# EAGLE design PhatStats Slim Enclosure ESP Lolin32 LITE XTP2046 PCB v1.0 (EAGLE 7.6.0)
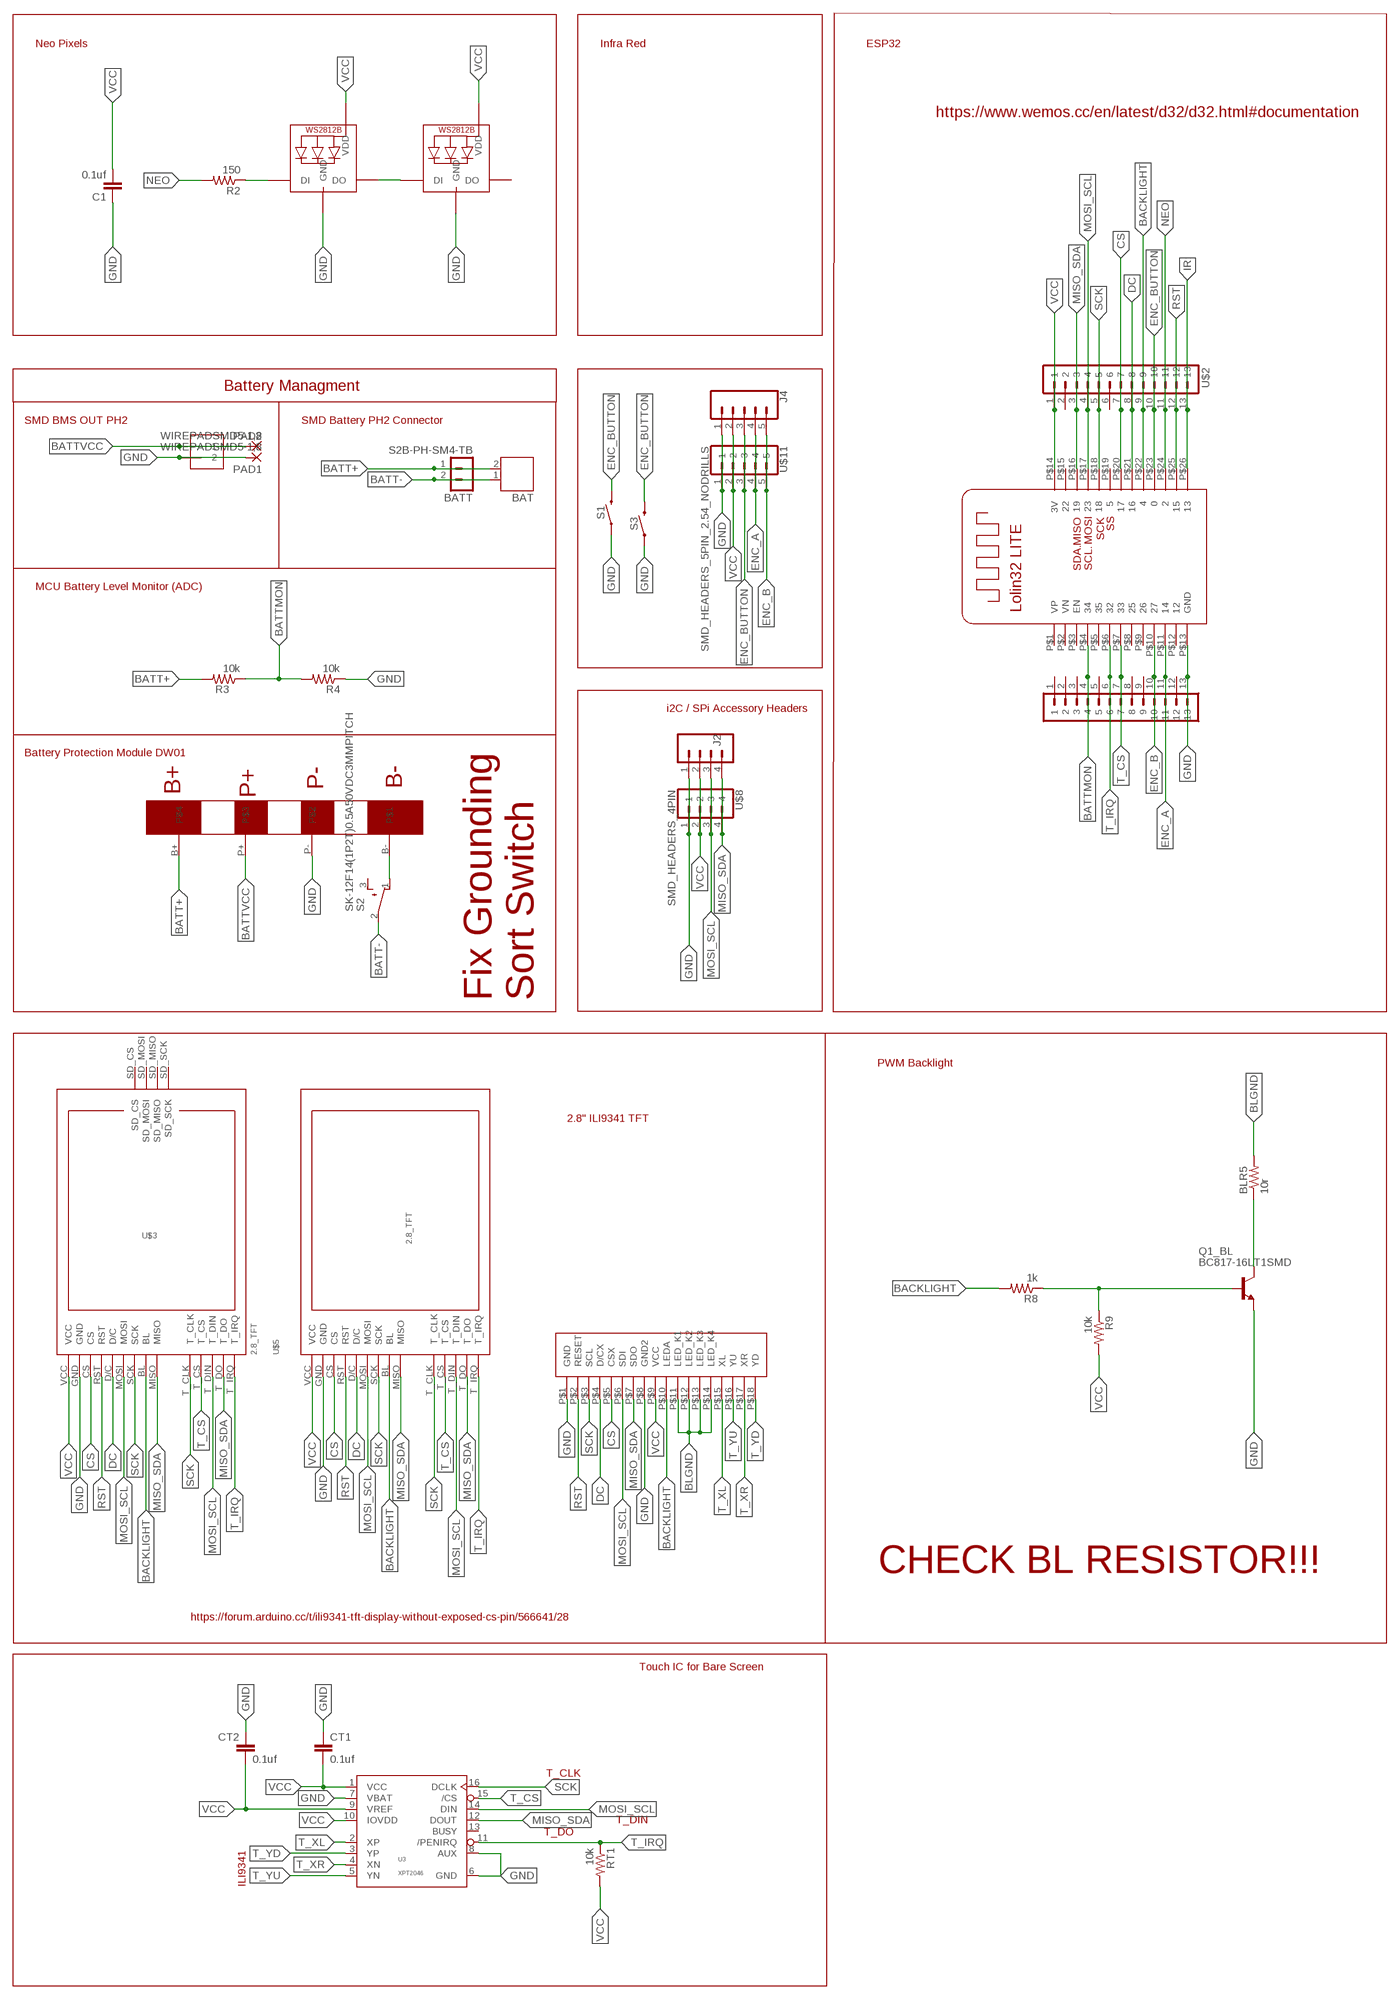
[diagram p0: schematic, sheet 1]

## Parts
0  ILI9341-2.8  [ILI9341-2.8]
BAT  JST-PH2  [JST-PH2]
BATT  S2B-PH-SM4-TB  [S2B-PH-SM4-TB]
BLR5  10r  R-US_M1206  [M1206]
C1  0.1uf  C-EUC1206  [C1206]
CT1  0.1uf  C-EUC1206  [C1206]
CT2  0.1uf  C-EUC1206  [C1206]
DW01-BMS  DW01BATTERYPROT  [DW01BATTERYPROT]
J1  1X2-3.5MM  [1X2-3.5MM]
J2  CONN_04PTH  [1X04]
J4  CONN_05  [1X05]
NEO1  WS2812B5050  [WS2812B]
NEO2  WS2812B5050  [WS2812B]
PAD1  WIREPADSMD5-1,8  [5-1,8]
PAD2  WIREPADSMD5-1,8  [5-1,8]
Q1_BL  BC817-16LT1SMD  [SOT23-BEC]
R2  150  R-US_M1206  [M1206]
R3  10k  R-US_M1206  [M1206]
R4  10k  R-US_M1206  [M1206]
R8  1k  R-US_M1206  [M1206]
R9  10k  R-US_M1206  [M1206]
RT1  10k  R-US_M1206  [M1206]
S1  MOMENTARY-SWITCH-SPST-PTH-6.0MM  [TACTILE_SWITCH_PTH_6.0MM]
S2  SK-12F14(1P2T)0.5A50VDC3MMPITCH  [SK-12F14(1P2T)0.5A50VDC3MMPITCH]
S3  MOMENTARY-SWITCH-SPST-SMD-6.2MM-TALL  [TACTILE_SWITCH_SMD_6.2MM_TALL]
U3  XPT2046  [TSSOP-16]
U$1  SMD_HEADERS_13PIN_2.54_NODRILLS  [SMD_HEADERS_13PIN]
U$2  SMD_HEADERS_13PIN_2.54_NODRILLS  [SMD_HEADERS_13PIN]
U$3  2.8_TFT  [2.8_TFT]
U$5  2.8_TFT  [2.8_TFT]
U$7  TML_LOLIND32_LITE  [TML_LOLIND32_LITE]
U$8  SMD_HEADERS_4PIN  [SMD_HEADERS_4PIN]
U$11  SMD_HEADERS_5PIN_2.54_NODRILLS  [SMD_HEADERS_5PIN]

## Nets
BACKLIGHT: 0.P$10(LEDA) R8.2 U$2.9 U$3.BL U$5.BL U$7.P$22
BATT+: BAT.2 BATT.1 DW01-BMS.B+ R3.2
BATT-: BAT.1 BATT.2 S2.2(P)
BATTMON: R3.1 R4.2 U$1.4 U$7.P$4
BATTVCC: DW01-BMS.P+ J1.1 PAD2.1(P)
BL: BLR5.1 Q1_BL.C
BLGND: 0.P$11(LED_K1) 0.P$12(LED_K2) 0.P$13(LED_K3) 0.P$14(LED_K4) BLR5.2
CS: 0.P$5(CSX) U$2.7 U$3.CS U$5.CS U$7.P$20
DC: 0.P$4(D/CX) U$2.8 U$3.D/C U$5.D/C U$7.P$21
ENC_A: J4.4 U$1.11 U$7.P$11 U$11.4
ENC_B: J4.5 U$1.10 U$7.P$10 U$11.5
ENC_BUTTON: J4.3 S1.3 S3.B2 U$2.10 U$7.P$23 U$11.3
GND: 0.P$1(GND) 0.P$8(GND2) C1.1 CT1.1 CT2.1 DW01-BMS.P- J1.2 J2.1 J4.1 NEO1.3-GND(GND) NEO2.3-GND(GND) PAD1.1(P) Q1_BL.E R4.1 S1.1 S3.A2 U3.6(GND) U3.7(VBAT) U3.8(AUX) U$1.13 U$3.GND U$5.GND U$7.P$13(GND) U$8.1 U$11.1
IR: U$2.13 U$7.P$26
MISO_SDA: 0.P$7(SDO) J2.4 U3.12(DOUT) U$2.3 U$3.MISO U$3.T_DO U$5.MISO U$5.T_DO U$7.P$16 U$8.4
MOSI_SCL: 0.P$6(SDI) J2.3 U3.14(DIN) U$2.4 U$3.MOSI U$3.T_DIN U$5.MOSI U$5.T_DIN U$7.P$17 U$8.3
N$1: DW01-BMS.B- S2.1(O)
N$2: NEO1.2-DOUT(DO) NEO2.4-DIN(DI)
N$4: NEO1.4-DIN(DI) R2.1
N$7: Q1_BL.B R8.1 R9.1
NEO: R2.2 U$2.11 U$7.P$24
RST: 0.P$2(RESET) U$2.12 U$3.RST U$5.RST U$7.P$25
SCK: 0.P$3(SCL) U3.16(DCLK) U$2.5 U$3.SCK U$3.T_CLK U$5.SCK U$5.T_CLK U$7.P$18
T_CS: U3.15(/CS) U$1.7 U$3.T_CS U$5.T_CS U$7.P$7
T_IRQ: RT1.1 U3.11(/PENIRQ) U$1.6 U$3.T_IRQ U$5.T_IRQ U$7.P$6
T_XL: 0.P$15(XL) U3.2(XP)
T_XR: 0.P$17(XR) U3.4(XN)
T_YD: 0.P$18(YD) U3.3(YP)
T_YU: 0.P$16(YU) U3.5(YN)
VCC: 0.P$9(VCC) C1.2 CT1.2 CT2.2 J2.2 J4.2 NEO1.1-VDD(VDD) NEO2.1-VDD(VDD) R9.2 RT1.2 U3.1(VCC) U3.9(VREF) U3.10(IOVDD) U$2.1 U$3.VCC U$5.VCC U$7.P$14(3V) U$8.2 U$11.2
Unconnected: NEO2.2-DOUT(DO) S2.3(S) U3.13(BUSY) U$1.1 U$1.2 U$1.3 U$1.5 U$1.8 U$1.9 U$1.12 U$2.2 U$2.6 U$3.SD_CS U$3.SD_MISO U$3.SD_MOSI U$3.SD_SCK U$7.P$1(VP) U$7.P$2(VN) U$7.P$3(EN) U$7.P$5 U$7.P$8 U$7.P$9 U$7.P$12 U$7.P$15 U$7.P$19

## Notes on the sheet
- Neo Pixels | Infra Red | ESP32
- https://www.wemos.cc/en/latest/d32/d32.html#documentation
- Battery Managment
- SMD BMS OUT PH2 | SMD Battery PH2 Connector
- MCU Battery Level Monitor (ADC)
- i2C / SPi Accessory Headers
- Battery Protection Module DW01
- Fix Grounding
  Sort Switch
- PWM Backlight
- 2.8" ILI9341 TFT
- CHECK BL RESISTOR!!!
- https://forum.arduino.cc/t/ili9341-tft-display-without-exposed-cs-pin/566641/28
- Touch IC for Bare Screen
- T_CLK
- T_DIN
- T_DO
- ILI9341

## Library data of the parts
0 = TML_ili9341_0.8Pitch_Header:ILI9341-2.8
BAT = jst-ph:JST-PH2
BATT = con-JST PH:S2B-PH: JST PH series header 2.00mm pitch disconnectable crimp style connectors, horizontal (side entry type), 2 pins
BLR5 R2-R4 R8 R9 RT1 = resistor:R-US_: RESISTOR, American symbol
C1 CT1 CT2 = rcl:C-EU: CAPACITOR, European symbol
DW01-BMS = TML_DW01_BatteryProtectionModule2:DW01BATTERYPROT
J1 = adafruit:1X2: 3.5mm Terminal block http://www.ladyada.net/library/pcb/eaglelibrary.html
J2 = SparkFun-Connectors:CONN_04: Multi connection point. Often used as Generic Header-pin footprint for 0.1 inch spaced/style header connections On any of the 0.1 inch spaced packages, you can populate with these: Break Away Headers - Straight <https://www.sparkfun.com/products/116> (PRT-00116) Break Away Male Headers - Right Angle <https://www.sparkfun.com/products/553> (PRT-00553) Female Headers <https://www.sparkfun.com/products/115> (PRT-00115) Break Away Headers - Machine Pin <https://www.sparkfun.com/products/117> (PRT-00117) Break Away Female Headers - Swiss Machine Pin <https://www.sparkfun.com/products/743> (PRT-00743) For SCREWTERMINALS and SPRING TERMINALS visit here: Screw Terimnals on SparkFun.com <https://www.sparkfun.com/search/results?term=Screw+Terminals> (5mm/3.5mm/2.54mm spacing) This device is also useful as a general connection point to wire up your design to another part of your project. Our various solder wires solder well into these plated through hole pads. Hook-Up Wire - Assortment (Stranded, 22 AWG) <https://www.sparkfun.com/products/11375> (PRT-11375) Hook-Up Wire - Assortment (Solid Core, 22 AWG) <https://www.sparkfun.com/products/11367> (PRT-11367) View the entire wire category on our website here <https://www.sparkfun.com/categories/141> Special notes: Molex polarized connector foot print use with SKU : PRT-08231 with associated crimp pins and housings. 1MM SMD Version SKU: PRT-10208; PROD_ID: CONN-09696
J4 = SparkFun-Connectors:CONN_05: Multi connection point. Often used as Generic Header-pin footprint for 0.1 inch spaced/style header connections On any of the 0.1 inch spaced packages, you can populate with these: Break Away Headers - Straight <https://www.sparkfun.com/products/116> (PRT-00116) Break Away Male Headers - Right Angle <https://www.sparkfun.com/products/553> (PRT-00553) Female Headers <https://www.sparkfun.com/products/115> (PRT-00115) Break Away Headers - Machine Pin <https://www.sparkfun.com/products/117> (PRT-00117) Break Away Female Headers - Swiss Machine Pin <https://www.sparkfun.com/products/743> (PRT-00743) For SCREWTERMINALS and SPRING TERMINALS visit here: Screw Terimnals on SparkFun.com <https://www.sparkfun.com/search/results?term=Screw+Terminals> (5mm/3.5mm/2.54mm spacing) This device is also useful as a general connection point to wire up your design to another part of your project. Our various solder wires solder well into these plated through hole pads. Hook-Up Wire - Assortment (Stranded, 22 AWG) <https://www.sparkfun.com/products/11375> (PRT-11375) Hook-Up Wire - Assortment (Solid Core, 22 AWG) <https://www.sparkfun.com/products/11367> (PRT-11367) View the entire wire category on our website here <https://www.sparkfun.com/categories/141> Special notes: Molex polarized connector foot print use with SKU : PRT-08231 with associated crimp pins and housings. 1MM SMD Version SKU: PRT-10208
NEO1 NEO2 = adafruit:WS2812B
PAD1 PAD2 = wirepad:WIREPAD: Wire PAD connect wire on PCB
Q1_BL = transistor-npn:BC817*: NPN Transistor
S1 = SparkFun-Switches:MOMENTARY-SWITCH-SPST: Momentary Switch (Pushbutton) - SPST Normally-open (NO) SPST momentary switches (buttons, pushbuttons). Variants PTH-12MM - 12mm square, through-hole Momentary Pushbutton Switch - 12mm Square <https://www.sparkfun.com/products/9190> (COM-09190) PTH-6.0MM, PTH-6.0MM-KIT - 6.0mm square, through-hole Mini Pushbutton Switch <https://www.sparkfun.com/products/97> (COM-00097) KIT package intended for soldering kit's - only one side of pads' copper is exposed. PTH-RIGHT-ANGLE-KIT - Right-angle, through-hole Right Angle Tactile Button <https://www.sparkfun.com/products/10791> - Used on SparkFun BigTime Watch Kit <https://www.sparkfun.com/products/11734> SMD-12MM - 12mm square, surface-mount Tactile Button - SMD (12mm) <https://www.sparkfun.com/products/12993> (COM-12993) Used on SparkFun PicoBoard <https://www.sparkfun.com/products/11888> SMD-4.5MM - 4.5mm Square Trackball Switch Used on SparkFun Blackberry Trackballer Breakout <https://www.sparkfun.com/products/13169> SMD-4.6MMX2.8MM - 4.60mm x 2.80mm, surface mount Used on SparkFun SAMD21 Mini Breakout <https://www.sparkfun.com/products/13664> SMD-5.2MM, SMD-5.2-REDUNDANT - 5.2mm square, surface-mount Mini Pushbutton Switch - SMD <https://www.sparkfun.com/products/8720> (COM-08720) Used on Arduino Pro Mini <https://www.sparkfun.com/products/11114> REDUNDANT package connects both switch circuits together SMD-6.0X3.5MM - 6.0 x 3.5mm, surface mount Momentary Reset Switch SMD <https://www.sparkfun.com/products/8229> (COM-08229) SMD-6.2MM-TALL - 6.2mm square, surface mount Tactile Button - SMD (6mm) <https://www.sparkfun.com/products/12992> Used on SparkFun Digital Sandbox <https://www.sparkfun.com/products/12651> SMD-RIGHT-ANGLE - Right-angle, surface mount Used on SparkFun Block for Intel® Edison - Arduino <https://www.sparkfun.com/products/13036>; PROD_ID: SWCH-08441; SF_SKU: COM-00097
S2 = TML_SK-12F14(1P2T)  90D 0.5a 50vdc 3mm pitch:SK-12F14(1P2T)0.5A50VDC3MMPITCH: SK-12F14(1P2T) 0.5a 50vdc 3mm pitch
S3 = SparkFun-Switches:MOMENTARY-SWITCH-SPST: Momentary Switch (Pushbutton) - SPST Normally-open (NO) SPST momentary switches (buttons, pushbuttons). Variants PTH-12MM - 12mm square, through-hole Momentary Pushbutton Switch - 12mm Square <https://www.sparkfun.com/products/9190> (COM-09190) PTH-6.0MM, PTH-6.0MM-KIT - 6.0mm square, through-hole Mini Pushbutton Switch <https://www.sparkfun.com/products/97> (COM-00097) KIT package intended for soldering kit's - only one side of pads' copper is exposed. PTH-RIGHT-ANGLE-KIT - Right-angle, through-hole Right Angle Tactile Button <https://www.sparkfun.com/products/10791> - Used on SparkFun BigTime Watch Kit <https://www.sparkfun.com/products/11734> SMD-12MM - 12mm square, surface-mount Tactile Button - SMD (12mm) <https://www.sparkfun.com/products/12993> (COM-12993) Used on SparkFun PicoBoard <https://www.sparkfun.com/products/11888> SMD-4.5MM - 4.5mm Square Trackball Switch Used on SparkFun Blackberry Trackballer Breakout <https://www.sparkfun.com/products/13169> SMD-4.6MMX2.8MM - 4.60mm x 2.80mm, surface mount Used on SparkFun SAMD21 Mini Breakout <https://www.sparkfun.com/products/13664> SMD-5.2MM, SMD-5.2-REDUNDANT - 5.2mm square, surface-mount Mini Pushbutton Switch - SMD <https://www.sparkfun.com/products/8720> (COM-08720) Used on Arduino Pro Mini <https://www.sparkfun.com/products/11114> REDUNDANT package connects both switch circuits together SMD-6.0X3.5MM - 6.0 x 3.5mm, surface mount Momentary Reset Switch SMD <https://www.sparkfun.com/products/8229> (COM-08229) SMD-6.2MM-TALL - 6.2mm square, surface mount Tactile Button - SMD (6mm) <https://www.sparkfun.com/products/12992> Used on SparkFun Digital Sandbox <https://www.sparkfun.com/products/12651> SMD-RIGHT-ANGLE - Right-angle, surface mount Used on SparkFun Block for Intel® Edison - Arduino <https://www.sparkfun.com/products/13036>; PROD_ID: SWCH-11966; SF_SKU: COM-12992
U3 = TML_XPT2046:XPT2046: XPT2046 touch screen controller General Description The XPT2046 is a 4-wire resistive touch screen controller that incorporates a 12-bit 125 kHz sampling SAR type A/D converter. The XPT2046 operates down to 2.2V supply voltage and supports digital I/O interface voltage from 1.5V to VCC in order to connect low voltage uP. The XPT2046 can detect the pressed screen location by performing two A/D conversions. In addition to location, the XPT2046 also measures touch screen pressure.On-chip VREF can be utilized for analog auxiliary input, temperature measurement and battery monitoring withthe ability to measure voltage from 0V to 5V. The XPT2046 also has an on-chip temperature sensor The XPT2046 is available in 16pin QFN thin package(0.75mm in height) and has the operating temperature range of -40°C to +85°C Features 12 bit SAR type A/D converter with S/H circuit Low voltage operation (VCC = 2.2V ∼ 3.6V) Low voltage digital I/F (1.5V ∼ VCC) 4-wire I/F Sampling frequency: 125 kHz (max) On-Chip voltage reference (2.5V) Pen pressure measurement On-chip thermo sensor Direct battery masurement Low power consumption (260μA) Package 16pin QFN Check prices <https://pricing.snapeda.com/parts/XPT2046/Xptek/view-part?ref=eda>; AVAILABILITY: Not in stock; DESCRIPTION: RASPBERRY PI 3.5 TFT DISPLAY; MF: Xptek; MP: XPT2046; PACKAGE: Package; PRICE: None
U$1 U$2 = TML_SMD_Headers_2.54_NoDrill:SMD_HEADERS_13PIN_2.54_NODRILLS
U$3 = TML_ili9341-2.8_tft-display_Corrected:2.8_TFT: ILI9341 2.8" 2.8 inch TFT SPI Touch Panel 240X320 http://www.lcdwiki.com/2.8inch_SPI_Module_ILI9341_SKU:MSP2807 http://www.lcdwiki.com/Run_Arduino_Demo_in_spi_model
U$5 = TML_ili9341-2.8_tft-display_PinHeader only:2.8_TFT: ILI9341 2.8" 2.8 inch TFT SPI Touch Panel 240X320 http://www.lcdwiki.com/2.8inch_SPI_Module_ILI9341_SKU:MSP2807 http://www.lcdwiki.com/Run_Arduino_Demo_in_spi_model
U$7 = TML_Wemos LOLIN32 LITE ESP32 Round Pads:TML_LOLIND32_LITE: Wemos Lolin32 LITE Lolin32 LITE is a development board based on ESP32. On this schematic, this board is designed with battery port. Pins VP and VN are Not Connected pins.
U$8 = TML_SMD_Headers_2.54_NoDrill:SMD_HEADERS_4PIN
U$11 = TML_SMD_Headers_2.54_NoDrill:SMD_HEADERS_5PIN_2.54_NODRILLS

## Board
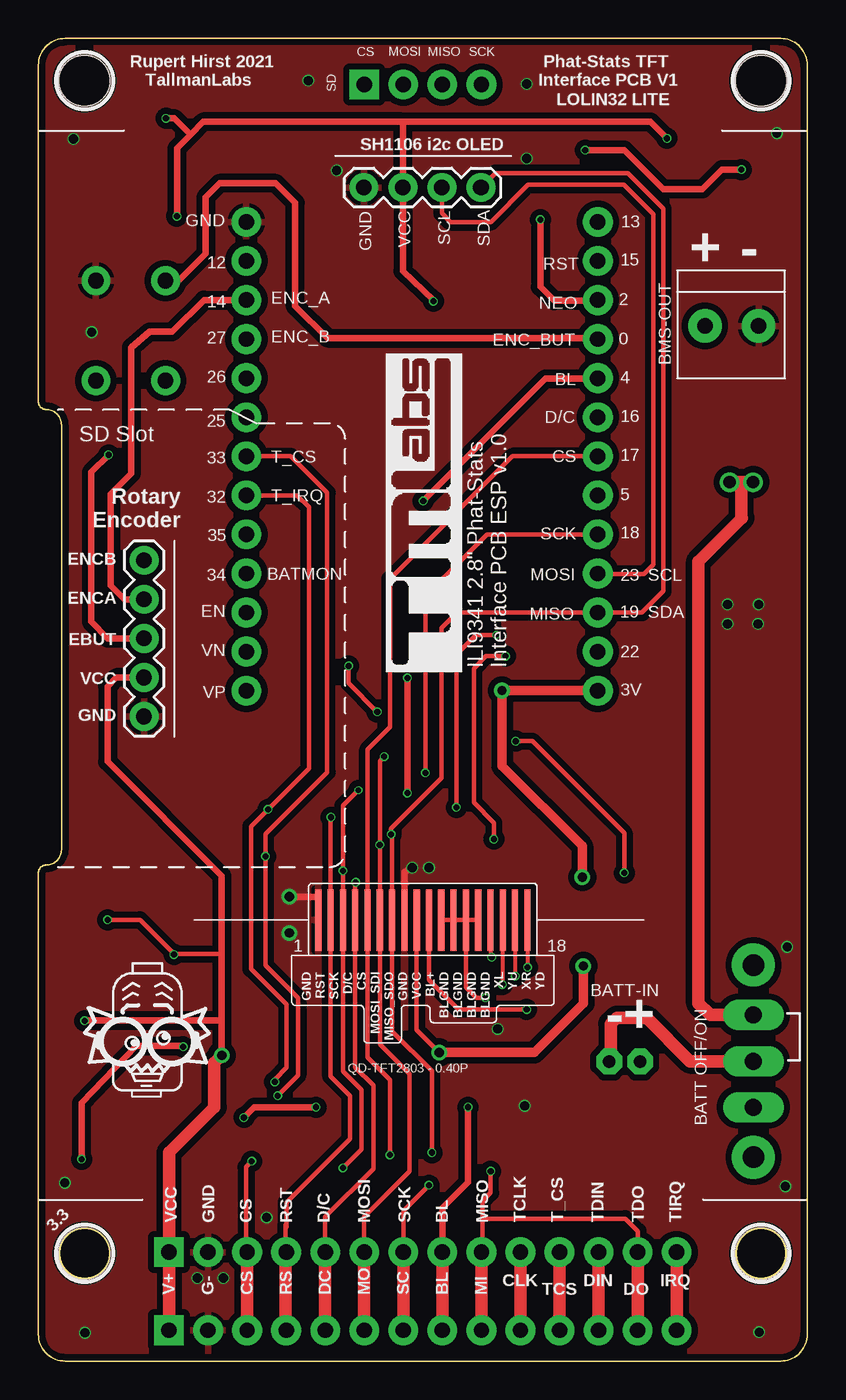
[diagram p1: board, top side]
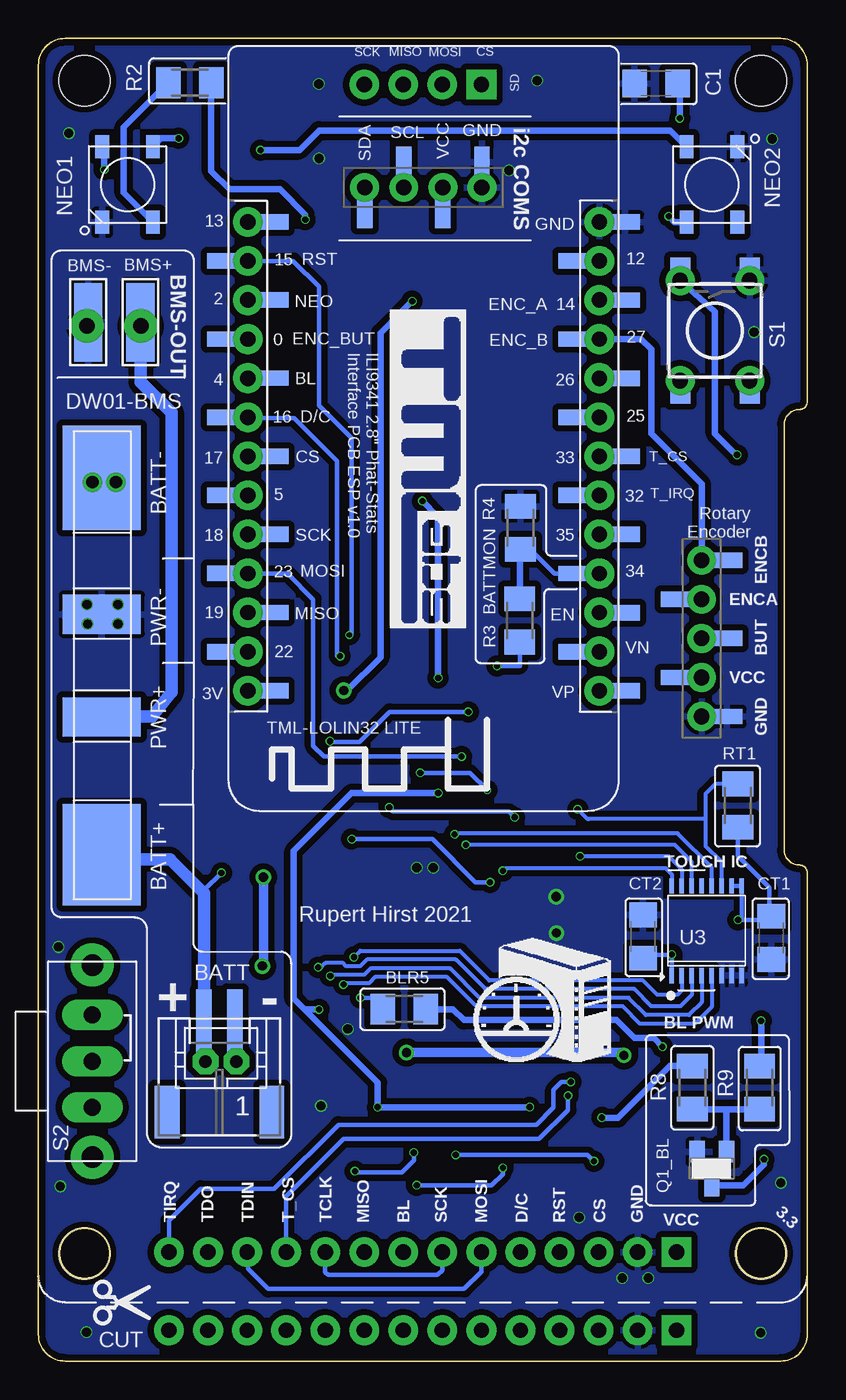
[diagram p2: board, bottom side, seen from below]

Size 50 x 86 mm. Coordinates in mm from the lower left corner, seen from the top.
Outline: 50,84.27 50,1.73 arc-90 48.27,0 1.73,0 arc-90 0,1.73 0,31.75 arc-90 0.5,32.25 arc90 1.5,33.25 1.5,60.88 arc90 0.5,61.88 arc-90 0,62.38 0,84.27 arc-90 1.73,86 48.27,86 arc-90 50,84.27
Outline: circle at 47,7 radius 1.6
Outline: circle at 3,7 radius 1.6
Copper layers (1*16): Top 0.035mm / dielectric 1.6mm / Bottom 0.035mm
Design rules "jlcpcb-2layers": minimum track width 5mil, minimum drill 0.3mm, track to track 5mil, track to pad 5mil, pad to pad 5mil, via to via 5mil, smd to smd 5mil, copper to edge 0.2mm, drill to drill 6mil, minimum pad ring 10mil, minimum via ring 3mil, stop-mask expansion 4mil, vias tented up to drill 0mil, thermal gap 10mil
Holes 3.3 mm at 3,83.25 47,83.25 47,7 3,7

### Footprints (pad centres in the part's own frame; a part is rotated, then mirrored left to right if it is on the bottom)
ILI9341-2.8 = smd 4 x 0.4: P$1 -18,6.8; P$2 -18,6; P$3 -18,5.2; P$4 -18,4.4; P$5 -18,3.6; P$6 -18,2.8; P$7 -18,2; P$8 -18,1.2; P$9 -18,0.4; P$10 -18,-0.4; P$11 -18,-1.2; P$12 -18,-2; P$13 -18,-2.8; P$14 -18,-3.6; P$15 -18,-4.4; P$16 -18,-5.2; P$17 -18,-6; P$18 -18,-6.8
JST-PH2 = drill 0.813 pad 1.676 octagon: 1 1,0; 2 -1,0
S2B-PH-SM4-TB = smd 1 x 4.5: 1 1,0; 2 -1,0 | smd 1.6 x 3.4: M1 3.4,5.75; M2 -3.4,5.75
M1206 = smd 1.6 x 2: 1 -1.4,0; 2 1.4,0
C1206 = smd 1.6 x 1.8: 1 -1.4,0; 2 1.4,0
DW01BATTERYPROT = smd 5.08 x 2.54: B+ 3.175,29.15; B+1 3.175,26.745; B+2 3.175,6.405; B+3 3.175,30.805; B- 3.175,4.31; B-1 3.175,2.155; P+ 3.175,19.839; P- 3.175,13.154
1X2-3.5MM = drill 1 pad 2.184: 1 1.8,0; 2 -1.7,0
1X04 = drill 1.016 pad 1.88: 1 0,0; 2 2.54,0; 3 5.08,0; 4 7.62,0
1X05 = drill 1.016 pad 1.88: 1 0,0; 2 2.54,0; 3 5.08,0; 4 7.62,0; 5 10.16,0
WS2812B = smd 1.5 x 0.9: 1-VDD 2.45,-1.65; 2-DOUT 2.45,1.65; 3-GND -2.45,1.65; 4-DIN -2.45,-1.65
5-1,8 = smd 1.829 x 5.08: 1 0,0
SOT23-BEC = smd 1 x 1.4: B -0.95,-1.1; C 0,1.1; E 0.95,-1.1
TACTILE_SWITCH_PTH_6.0MM = drill 1.016 pad 1.88: 1 -3.251,2.261; 2 3.251,2.261; 3 -3.251,-2.261; 4 3.251,-2.261
SK-12F14(1P2T)0.5A50VDC3MMPITCH = drill 1.1 pad 1.422 long: 1 -3,0; 2 0,0; 3 3,0 | drill 1.4 pad 2.8: M1 -6.25,0; M2 6.25,0
TACTILE_SWITCH_SMD_6.2MM_TALL = smd 1.55 x 1.3: A1 -3.975,-2.25; A2 3.975,-2.25; B1 -3.975,2.25; B2 3.975,2.25
TSSOP-16 = smd 0.305 x 0.991: 1 -2.275,-2.918; 2 -1.625,-2.918; 3 -0.975,-2.918; 4 -0.325,-2.918; 5 0.325,-2.918; 6 0.975,-2.918; 7 1.625,-2.918; 8 2.275,-2.918; 9 2.275,2.918; 10 1.625,2.918; 11 0.975,2.918; 12 0.325,2.918; 13 -0.325,2.918; 14 -0.975,2.918; 15 -1.625,2.918; 16 -2.275,2.918
SMD_HEADERS_13PIN = smd 1 x 2: 1 1.27,-0.38; 2 3.81,2.92; 3 6.35,-0.38; 4 8.89,2.92; 5 11.43,-0.38; 6 13.97,2.92; 7 16.51,-0.38; 8 19.05,2.92; 9 21.59,-0.38; 10 24.13,2.92; 11 26.67,-0.38; 12 29.21,2.92; 13 31.75,-0.38
2.8_TFT = drill 1 pad 1.93: BL 26.27,2; CS 13.57,2; D/C 18.65,2; GND 11.03,2; MISO 28.81,2; MOSI 21.19,2; RST 16.11,2; SCK 23.73,2; SD_MISO 26.27,83; SD_MOSI 23.73,83; SD_SCK 28.81,83; T_CLK 31.35,2; T_CS 33.89,2; T_DIN 36.43,2; T_DO 38.97,2; T_IRQ 41.51,2 | drill 1 pad 1.93 square: SD_CS 21.19,83; VCC 8.49,2
2.8_TFT' = drill 1 pad 1.93: BL 26.27,2; CS 13.57,2; D/C 18.65,2; GND 11.03,2; MISO 28.81,2; MOSI 21.19,2; RST 16.11,2; SCK 23.73,2; T_CLK 31.35,2; T_CS 33.89,2; T_DIN 36.43,2; T_DO 38.97,2; T_IRQ 41.51,2 | drill 1 pad 1.93 square: VCC 8.49,2
TML_LOLIND32_LITE = drill 1 pad 1.93: P$1 -11.48,17.91; P$2 -11.48,15.37; P$3 -11.48,12.83; P$4 -11.48,10.29; P$5 -11.48,7.75; P$6 -11.48,5.21; P$7 -11.48,2.67; P$8 -11.48,0.13; P$9 -11.48,-2.41; P$10 -11.48,-4.95; P$11 -11.48,-7.49; P$12 -11.48,-10.03; P$13 -11.48,-12.57; P$14 11.38,17.91; P$15 11.38,15.37; P$16 11.38,12.83; P$17 11.38,10.29; P$18 11.38,7.75; P$19 11.38,5.21; P$20 11.38,2.67; P$21 11.38,0.13; P$22 11.38,-2.41; P$23 11.38,-4.95; P$24 11.38,-7.49; P$25 11.38,-10.03; P$26 11.38,-12.57
SMD_HEADERS_4PIN = smd 1 x 2: 1 1.27,-0.38; 2 3.81,2.92; 3 6.35,-0.38; 4 8.89,2.92
SMD_HEADERS_5PIN = smd 1 x 2: 1 1.27,-0.38; 2 3.81,2.92; 3 6.35,-0.38; 4 8.89,2.92; 5 11.43,-0.38

### Placement (x,y rotation side)
0  25,46.68 90 top
BAT  38.13,19.48 0 bottom
BATT  38.23,21.93 180 bottom
BLR5  26.2,22.89 180 bottom
C1  9.84,83.07 0 bottom
CT1  2.33,27.52 90 bottom
CT2  10.68,27.61 270 bottom
DW01-BMS  42.7,61.71 180 bottom
J1  45.15,67.31 180 top
J2  21.16,76.31 0 top
J4  6.87,41.91 90 top
NEO1  44.2,76.5 90 bottom
NEO2  6.2,76.5 270 bottom
PAD1  46.76,67.54 0 bottom
PAD2  43.37,67.54 0 bottom
Q1_BL  6.21,12.51 180 bottom
R2  40.16,83.12 0 bottom
R3  18.7,48.16 270 bottom
R4  18.66,54.17 270 bottom
R8  7.47,17.78 90 bottom
R9  3.1,17.78 90 bottom
RT1  4.52,36.12 270 bottom
S1  6,67 270 bottom
S2  46.5,19.5 270 bottom
S3  6,67 90 bottom
U3  6.54,27.98 0 bottom
U$1  12.25,42.32 90 bottom
U$2  35.11,42.32 90 bottom
U$3  0,0 0 top
U$4  [HSMSMALL]  21.49,18.52 0 bottom
U$5  2.8_TFT  [2.8_TFT']  0,5.08 0 top
U$6  [MADPROF]  4.8,16.93 0 top
U$7  25,61.5 180 bottom
U$8  19.89,77.57 180 bottom
U$9  [TMSLOGO_INVERTED]  28.47,69.01 270 bottom
U$10  [TMSLOGO_INVERTED]  28.89,44.16 90 top
U$11  5.6,40.64 90 bottom
U$13  [SCISSORS_TS]  46.99,5.08 0 bottom

### Tracks (layer width: path | path; a pad name or v marks a point on that pad's centre or on a via)
BACKLIGHT  (via drill 0.4)
  Top 0.305: 0.P$10 25.4,24.8 27.33,22.86 v31.75,22.86 | 36.23,63.88 U$7.P$22
  Top 0.406: v24,44.42 v24,36.94 | v25.02,55.92 32.98,63.88 36.23,63.88 | v18.05,16.51 14.04,16.51 v13.36,15.84 | U$5.BL 26.27,9.96 27.94,11.63 v27.94,16.51
  Top 0.813: U$3.BL U$5.BL
  Bottom 0.305: v25.02,55.92 25.02,55.91
  Bottom 0.406: v24,44.42 24,54.88 25.02,55.91 | R8.2 8.95,19.18 12.31,15.81 13.34,15.81 v13.36,15.84 | U$7.P$22 U$2.9 | U$2.9 | v18.05,16.51 v27.94,16.51 27.94,18.11 32.69,22.86 | v24,36.94 29.62,36.94 33.4,33.17 33.4,23.57 32.69,22.86 | 32.69,22.86 v31.75,22.86
BATT+  (via drill 0.4)
  Top 0.305: v22.04,42.21 20.18,44.08 v20.18,45.2 | v31.04,40.31 32.12,40.31 38.1,34.33 v38.1,31.75
  Bottom 0.152: 45.81,32.62 DW01-BMS.B+
  Bottom 0.305: v22.04,42.21 27.16,42.21 29.11,40.27 31,40.27 v31.04,40.31 | v20.18,45.2 18.7,45.2 R3.2 | v38.1,31.75 39.23,30.62 39.23,30.42
  Bottom 0.406: 18.38,46.7 R3.2 | BATT.1 39.13,21.93 BAT.2
  Bottom 0.813: BATT.1 39.23,30.42 41.44,32.62 45.81,32.62
BATT-
  Top 0.813: S2.2 42.38,19.5 39.56,22.31 39.37,22.31 37.61,22.31 BATT.2 37.23,19.58 BAT.1
  Bottom 0.406: BATT.2 37.13,21.93
  Bottom 0.813: BATT.2 37.31,21.93 37.31,21.94 | 37.13,21.93 BAT.1
BATTMON
  Bottom 0.305: 18.57,52.69 R4.2 | 18.7,52.73 17.97,52.73 16.44,51.2 15.24,51.2 | 15.24,51.2 14.38,51.2 14.37,51.21 | U$7.P$4 15.23,51.21 15.24,51.2
  Bottom 0.406: R3.1 18.7,52.73 R4.2 | U$7.P$4 14.37,51.21 U$1.4
BATTVCC
  Bottom 0.406: J1.1 43.37,67.31 PAD2.1
  Bottom 0.813: J1.1 43.34,63.66 41.35,61.67 41.35,43.52 42.62,41.91 45.46,41.91 DW01-BMS.P+
BL  (via drill 0.4)
  Top 0.406: v2.81,13.12 2.81,16.78 6.35,20.51 9.35,20.51 v9.42,20.44
  Bottom 0.406: Q1_BL.C 4.15,11.41 2.81,12.75 v2.81,13.12 | v9.42,20.44 9.98,21 11.26,21 12.43,22.17 22.33,22.17 23.04,22.88 24.8,22.88 BLR5.1
BLGND  (via drill 0.4)
  Top 0.305: 0.P$14 0.P$13 | 0.P$13 0.P$12 0.P$11 | 0.P$13 27.8,24.3 28.48,23.62 v29.06,23.62
  Top 0.406: 0.P$13 27.77,28.68
  Bottom 0.305: v29.06,23.62 28.12,23.62 27.61,23.11 BLR5.2
  Bottom 0.406: BLR5.2 27.61,22.95 27.9,23.25
CS  (via drill 0.4)
  Top 0.305: U$7.P$20 30.84,58.83 22.86,50.85 22.86,41.22 21.41,39.76 21.41,35.38 0.P$5 21.4,19.76 22.86,18.3 v22.86,13.41 | U$5.CS 13.49,7.16 13.49,12.62 v13.87,12.99
  Top 0.813: U$3.CS U$5.CS
  Bottom 0.305: v22.86,13.41 14.29,13.41 v13.87,12.99
  Bottom 0.406: U$7.P$20 U$2.7 | U$2.7
DC  (via drill 0.4)
  Top 0.305: U$5.D/C 18.65,9.38 21.78,12.51 21.78,17.93 20.6,19.1 0.P$4 20.6,31.1 v20.62,31.12 | v29.62,33.94 29.62,35 28.31,36.31 28.31,45.04 29.11,45.84 v30.38,45.84
  Top 0.813: U$3.D/C U$5.D/C
  Bottom 0.305: v30.38,45.84 30.57,45.84 30.57,58.51 33.38,61.31 36.32,61.31 U$7.P$21 | v20.62,31.12 21.56,31.12 24.38,33.94 v29.62,33.94
  Bottom 0.406: U$7.P$21 U$2.8 | U$2.8
ENC_A
  Top 0.406: J4.4 5.6,49.53 4.71,50.42 4.71,56.38 6.04,57.71 6.04,65.91 7.25,66.94 8.7,66.94 10.76,69 13.37,69 U$7.P$11
  Bottom 0.406: U$1.11 U$7.P$11 | U$11.4 J4.4
ENC_B
  Bottom 0.406: U$1.10 U$7.P$10 10.81,66.45 10.15,65.78 10.15,60.3 6.87,57.02 J4.5 U$11.5
ENC_BUTTON  (via drill 0.4)
  Top 0.406: J4.3 4.52,46.99 3.44,48.07 3.44,57.8 v4.56,58.92 | S1.3 8.12,70.35 9.22,70.35 10.88,72 10.88,75.67 11.78,76.58 15.43,76.58 16.7,75.31 16.7,68.58 18.79,66.53 36.12,66.52 U$7.P$23
  Bottom 0.406: v4.56,58.92 4.61,58.92 6,60.31 6,68.23 S1.3 | 8.06,70.29 S1.3 | S1.3 8.09,71 S3.B2 | U$7.P$23 U$2.10 | U$2.10 | U$11.3 J4.3
GND  (via drill 0.6, 0.6 pad 1)
  Top 0.406: 0.P$1 18.21,30.18 v16.32,30.19 | 0.P$8 23.8,31.79 v24.32,32.08
  Bottom 0.305: v44.83,47.93 44.83,48.53 | v46.84,49.2 46.52,49.2 DW01-BMS.P- 46.17,48.56 v46.8,47.93
  Bottom 0.406: U$7.P$13 U$1.13
  Bottom 0.813: 46.99,66.75 PAD1.1 | v44.83,49.2 44.83,48.53 DW01-BMS.P-
  other vias: 46.88,1.88 1.71,11.59 3.02,1.84 12.03,5.4 3.46,66.9 48.02,79.84 2.27,79.47 14.84,9.34 10.34,5.4 31.76,83.05 29.88,21.59 48.58,11.36 31.62,16.59 17.56,83.26 19.39,77.42 31.75,78.2 25.4,32.08 48.7,26.93 16.31,27.84
  pour Bottom (isolate 0.406): -1.27,-1.27 -1.27,87.63 50.8,87.63 50.8,-1.27
  pour Top (isolate 0.406): 52.07,-2.54 52.07,88.9 -2.54,88.9 -2.54,-2.54
IR
  Bottom 0.254: U$7.P$26 U$2.13 | U$2.13
MISO_SDA  (via drill 0.4)
  Top 0.305: v25.59,13.55 25.59,18.86 23,21.45 0.P$7 23,34.25 v22.93,34.25 22.93,34.63 26.21,37.9 26.21,47.65 27.23,48.67 U$7.P$16 39.25,48.67 40.64,50.06 40.64,74.93 38.32,77.25 29.72,77.25 J2.4 | U$5.MISO 28.81,7.62 28.88,7.68 28.88,9.27 | v29.41,12.34 29.41,10.93 28.88,10.39 28.88,9.27 | 28.88,9.27 38.17,9.27 39,8.44 39,7.11 U$5.T_DO
  Top 0.813: U$3.MISO U$5.MISO | U$3.T_DO U$5.T_DO
  Bottom 0.254: U3.12 6.21,32.09 8.44,34.31 22.93,34.31 v22.93,34.25
  Bottom 0.305: v29.41,12.34 29.34,12.27 26.36,12.27 25.59,13.04 v25.59,13.55 | U$7.P$16 35.48,48.67
  Bottom 0.406: U$7.P$16 35.56,48.67 | U$2.3 35.48,48.67 | 35.48,48.67 | U$8.4 J2.4
MOSI_SCL  (via drill 0.4)
  Top 0.305: v22.48,39.31 22.2,39.03 v22.2,33.56 22.2,33.42 0.P$6 22.2,20.61 24.13,18.68 24.13,12.32 21.19,9.38 U$5.MOSI | J2.3 26.24,74.64 26.81,74.06 29.44,74.06 31.85,76.48 38.09,76.48 39.98,74.58 39.98,51.8 39.38,51.19 36.4,51.19 U$7.P$17
  Top 0.813: U$5.MOSI U$3.MOSI | U$5.T_DIN U$3.T_DIN
  Bottom 0.254: U3.14 7.51,32.45 8.62,33.56 v22.2,33.56
  Bottom 0.305: U$7.P$17 33.8,51.21 32.12,49.53 32.12,40 31.43,39.31 v22.48,39.31 | U$5.MOSI 21.19,5.81 22.31,4.69 35.06,4.69 36.38,6 36.38,7.03 U$5.T_DIN
  Bottom 0.406: U$7.P$17 U$2.4 | U$2.4 | U$8.3 J2.3
N$1  (via drill 0.8 pad 1.27)
  Top 0.813: S2.1 43.69,22.5 42.92,23.26 42.92,51.99 45.75,54.82 45.72,54.82 45.72,57.15 | v46.48,57.15 45.72,57.15 | 45.72,57.15 v44.96,57.15
  Bottom 0.813: DW01-BMS.B- 45.72,57.4 45.72,57.15 v46.48,57.15
N$2  (via drill 0.4)
  Top 0.406: v45.72,77.47 44.45,77.47 43.18,76.2 40.64,76.2 38.1,78.74 v35.56,78.74
  Bottom 0.406: NEO1.2-DOUT 45.72,78.97 v45.72,77.47 | NEO2.4-DIN 8.91,80.01 31.75,80.01 33.02,78.74 v35.56,78.74
N$4
  Bottom 0.406: NEO1.4-DIN 44.45,75.98 44.45,80.22 R2.1
N$7
  Bottom 0.406: R9.1 5.27,16.38 | 5.27,16.38 R8.1 | 5.27,16.38 5.27,13.62 Q1_BL.B
NEO  (via drill 0.4)
  Top 0.152: U$7.P$24 36.34,68.94
  Top 0.406: 36.34,68.94 33.55,68.94 32.65,69.85 v32.65,74.22
  Bottom 0.406: R2.2 38.76,77.38 37.58,76.2 34.29,76.2 32.65,74.56 v32.65,74.22 | U$7.P$24 U$2.11 | U$2.11
RST  (via drill 0.35, 0.4)
  Top 0.305: U$3.RST 16.09,2 | U$5.RST 16.12,7.12 | v27.19,36 27.19,45.94 28.46,47.21 v29.77,47.21 | 16.12,8.74 16.12,8.89 | 16.12,8.89 16.12,10.34 20.25,14.46 20.25,17.25 19,18.5 0.P$2 19,35.33 v19.03,35.36 | 16.12,8.89 16.09,8.85 16.09,7.06
  Top 0.813: 16.09,2 16.09,7.06 U$5.RST
  Bottom 0.305: v27.19,36 26.92,35.73 19.4,35.73 v19.03,35.36 | v29.77,47.21 29.62,47.21 29.62,60 31.75,62.12 31.75,69.85 33.43,71.53 U$7.P$25
  Bottom 0.406: U$7.P$25 U$2.12 | U$2.12
SCK  (via drill 0.35, 0.4)
  Top 0.305: U$5.SCK 23.73,7.62 23.73,9.76 v25.4,11.43 | v25.17,38.25 25.17,49.76 29.16,53.75 U$7.P$18 | v20.81,37.12 19.8,36.11 v19.8,31.88 0.P$3 19.8,18.82 21,17.62 21,13.76 v19.8,12.55
  Top 0.813: U$3.T_CLK U$5.T_CLK | U$3.SCK 23.73,7.62
  Bottom 0.254: v19.8,31.88 19.61,32.06 9.22,32.06 8.81,31.65 U3.16
  Bottom 0.305: v25.17,38.25 21.94,38.25 v20.81,37.12 | U$5.T_CLK 31.35,5.77 31.18,5.59 24.03,5.59 23.73,5.89 U$5.SCK | v25.4,11.43 20.52,11.43 19.8,12.15 v19.8,12.55
  Bottom 0.406: U$7.P$18 U$2.5 | U$2.5
T_CS  (via drill 0.4)
  Top 0.305: v15.56,17.25 16.88,18.56 16.88,23.62 14.77,25.73 v14.77,32.81 14.77,34.27 18.77,38.27 18.77,56.46 16.4,58.83 U$7.P$7
  Top 0.813: U$3.T_CS U$5.T_CS
  Bottom 0.254: v14.77,32.81 14.75,32.83 9.02,32.83 8.16,31.98 U3.15
  Bottom 0.305: U$5.T_CS 33.89,10.71 30.16,14.44 17.44,14.44 15.56,16.31 v15.56,17.25
  Bottom 0.406: U$7.P$7 U$1.7
T_IRQ  (via drill 0.4)
  Top 0.305: v15.38,18.14 15.38,18.33 16.12,19.08 16.12,23.18 13.82,25.48 13.82,34.77 v14.93,35.87 17.59,38.53 17.59,55.53 16.84,56.29 U$7.P$6
  Top 0.813: U$3.T_IRQ U$5.T_IRQ
  Bottom 0.254: v14.93,35.87 14.31,35.25 14.18,35.25 6.62,35.25 | U3.11 5.56,32.45 6.62,33.51 6.62,35.25 | RT1.1 5.98,37.52 6.62,36.88 6.62,35.25
  Bottom 0.305: U$5.T_IRQ 41.51,9.14 39.45,11.21 34.66,11.21 30.49,15.38 17.62,15.38 16.5,16.5 16.5,17.62 15.98,18.14 v15.38,18.14
  Bottom 0.406: U$7.P$6 U$1.6
T_XL  (via drill 0.4)
  Top 0.254: 0.P$15 29.41,28.67 29.41,26.34 v29.48,26.27
  Bottom 0.254: U3.2 8.16,24.09 8.44,23.81 9.75,23.81 10.69,24.75 20.67,24.75 22.6,26.68 29.07,26.68 v29.48,26.27
T_XR  (via drill 0.4)
  Top 0.254: 0.P$17 31,25.06 v31.02,25.04
  Bottom 0.254: U3.4 6.86,23.33 7.69,22.51 10.51,22.51 11.62,23.62 21.31,23.62 23.21,25.53 28.41,25.53 28.8,25.14 30.92,25.14 v31.02,25.04
T_YD  (via drill 0.4)
  Top 0.254: 0.P$18 31.8,25.61 v31.81,25.6
  Bottom 0.254: U3.3 7.51,23.8 8.24,23.07 10.14,23.07 11.25,24.19 20.93,24.19 22.86,26.11 28.64,26.11 29.08,25.67 29.98,25.67 30.19,25.88 31.35,25.88 31.62,25.6 v31.81,25.6
T_YU  (via drill 0.4)
  Top 0.254: 30.19,28.67 30.19,24.51 v30.16,24.49
  Top 0.305: 30.19,28.67 0.P$16
  Bottom 0.254: U3.5 6.21,23.04 7.31,21.94 10.88,21.94 12,23.06 21.52,23.06 23.43,24.97 28.1,24.97 28.51,24.56 30.1,24.56 v30.16,24.49
VCC  (via drill 0.4, 0.6 pad 1, 0.6 pad 1.02)
  Top 0.305: 0.P$9 24.6,21.53 v26.06,20.06 | v9,74.44 9.01,74.62 | v4.5,28.69 6.61,28.69 8.81,26.48 v8.81,26.44 | 8.86,26.48 11.92,26.48
  Top 0.406: v25.69,68.91 25.69,69 23.7,70.88 23.7,76.2 J2.2 23.7,80.42 23.74,80.46 23.62,80.57 | 23.62,80.57 39.8,80.57 v40.88,79.5 | 9.01,74.62 9.01,78.86 9.89,79.74 | 23.62,80.57 10.72,80.57 9.89,79.74 | v8.29,80.81 8.81,80.81 9.89,79.74 | 11.92,22.15 11.92,26.48 11.92,31.56 4.5,38.98 4.5,43.88 5.06,44.44 6.86,44.44 J4.2 | 11.92,22.15 v11.92,19.88 | v8.81,26.44 8.86,26.48 | v3,22.12 3.03,22.15 11.92,22.15
  Top 0.61: v26.06,20.06 32.26,20.06 35.45,23.25 v35.45,25.68 v35.44,25.69 | v35.37,31.46 35.37,33.48 30.15,38.7 v30.15,43.6 U$7.P$14 36.4,43.59 U$7.P$14
  Top 0.813: U$3.VCC U$5.VCC 8.49,13.57 11.43,16.51 11.43,19.38 v11.92,19.88
  Bottom 0.305: U3.1 v8.81,26.44 8.86,26.39 10.49,26.39 CT2.2 | 2.48,29.62 2.33,29.48 CT1.2 | U3.10 U3.9 4.26,28.69 v4.5,28.69 2.48,28.69 2.48,29.62 | RT1.2 4.52,32.83 2.48,30.79 2.48,29.62
  Bottom 0.406: NEO2.1-VDD 8.63,74.07 v9,74.44 | v40.88,79.5 42.01,79.5 NEO1.1-VDD | v8.29,80.81 8.29,82.6 C1.2 | v30.15,43.6 29.92,43.6 27.75,45.76 27.75,66.85 v25.69,68.91 | U$7.P$14 U$2.1 | U$2.1 | R9.2 3,19.18 v3,22.12 | U$8.2 J2.2 | U$11.2 J4.2
  Bottom 0.61: v35.44,25.69 35.37,25.75 v35.37,31.46 | v11.92,19.88 12.11,20.06 v26.06,20.06

### Text on the board
tPlace: Rupert Hirst 2021 / TallmanLabs | Phat-Stats TFT / Interface PCB V1 | LOLIN32 LITE | SH1106 i2c OLED | GND | GND | VCC | SCL | SDA | 13 | 12 | RST | 15 | + | - | BMS-OUT | 14 | ENC_A | NEO | 2 | 27 | ENC_BUT | ENC_B | 0 | 26 | BL | 4 | 25 | D/C | 16 | SD Slot | 33 | CS | 17 | T_CS | Rotary / Encoder | 32 | T_IRQ | 5 | 35 | SCK | ENCB | 18 | 34 | MOSI | BATMON | 23 | SCL | ENCA | EN | MISO | 19 | SDA | EBUT | VN | 22 | VCC | ILI9341 2.8" Phat-Stats / Interface PCB ESP v1.0 | VP | 3V | GND | BATT-IN | - | + | QD-TFT2803 - 0.40P | BATT OFF/ON | VCC | GND | CS | RST | D/C | MOSI | SCK | BL | MISO | TCLK | T_CS | TDIN | TDO | TIRQ | 3.3 | CLK | DIN | IRQ | TCS | DO | V+ | G- | CS | RS | DC | MO | SC | BL | MI
bPlace: VCC | i2c COMS | GND | SCL | SDA | 13 | GND | BMS+ | BMS- | 12 | RST | 15 | BMS-OUT | 2 | 14 | ENC_A | NEO | ENC_B | 27 | ILI9341 2.8" Phat-Stats / Interface PCB ESP v1.0 | ENC_BUT | 0 | 26 | BL | 4 | 25 | D/C | 16 | 33 | 17 | T_CS | CS | Rotary / Encoder | T_IRQ | 32 | 5 | ENCB | 35 | 18 | SCK | 34 | MOSI | 23 | ENCA | EN | BATTMON | 19 | BUT | MISO | VN | 22 | VCC | VP | 3V | GND | TOUCH IC | Rupert Hirst 2021 | BL PWM | - | + | 3.3 | VCC | GND | CS | RST | D/C | MOSI | SCK | BL | MISO | TCLK | T_CS | TDIN | TDO | TIRQ